# EAGLE design BladeCore-M54 (EAGLE 9.2.1)

## Sheet 1 of 2
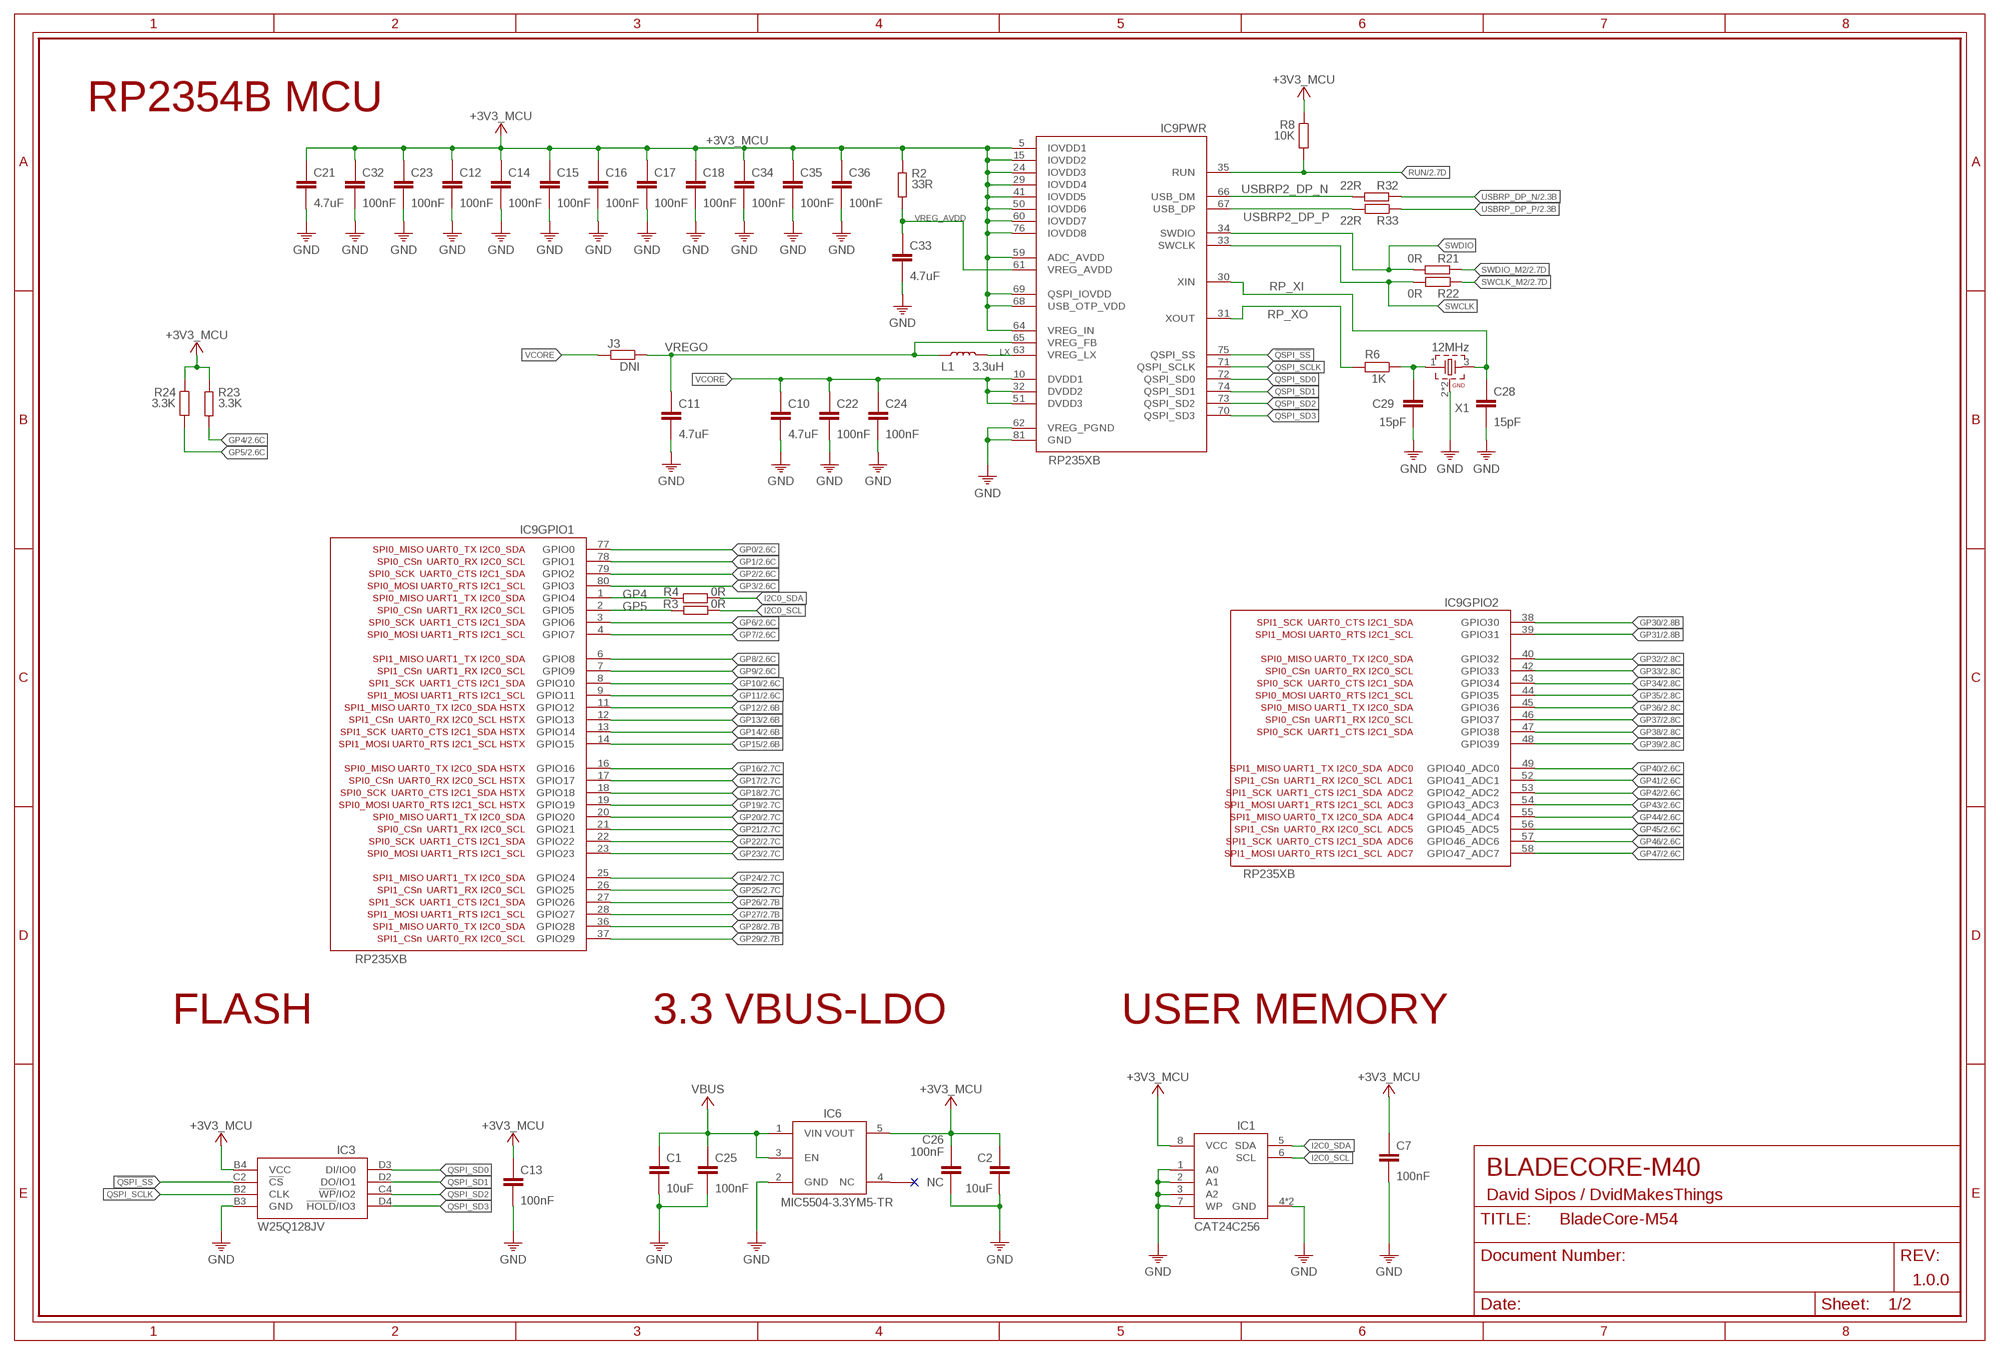
[diagram p0: schematic, sheet 1]

### Parts
C1  10uF  C0805  [0805]
C2  10uF  C0805  [0805]
C7  100nF  C-0201  [0201]
C10  4.7uF  C-0201  [0201]
C11  4.7uF  C-0201  [0201]
C12  100nF  C-0201  [0201]
C13  100nF  C-0201  [0201]
C14  100nF  C-0201  [0201]
C15  100nF  C-0201  [0201]
C16  100nF  C-0201  [0201]
C17  100nF  C-0201  [0201]
C18  100nF  C-0201  [0201]
C21  4.7uF  C-0402  [C0402]
C22  100nF  C-0201  [0201]
C23  100nF  C-0201  [0201]
C24  100nF  C-0201  [0201]
C25  100nF  C-0201  [0201]
C26  100nF  C-0201  [0201]
C28  15pF  C-0201  [0201]
C29  15pF  C-0201  [0201]
C32  100nF  C-0201  [0201]
C33  4.7uF  C-0201  [0201]
C34  100nF  C-0201  [0201]
C35  100nF  C-0201  [0201]
C36  100nF  C-0201  [0201]
IC1  CAT24C512HU5IGT3  CAT24C256-HU4  [SON50P300X200X50-9T130X140N]
IC3  W25Q128JVCIQ TR  W25Q128JVC  [BGA24C100P4X6_800X600X120N]
IC6  MIC5504-3.3YM5-TR  [SOT23-5]
IC9  RP235XB  [QFN80-10X10]
J3  DNI  R0201  [R0201]
L1  3.3uH  L  [SRR5228A]
R2  33R  R0201  [R0201]
R3  0R  R0201  [R0201]
R4  0R  R0201  [R0201]
R6  1K  R0201  [R0201]
R8  10K  R0201  [R0201]
R21  0R  R0201  [R0201]
R22  0R  R0201  [R0201]
R23  3.3K  R0201  [R0201]
R24  3.3K  R0201  [R0201]
R32  22R  R0201  [R0201]
R33  22R  R0201  [R0201]
X1  12MHz  WE-XTAL_CFPX-180_830069944  [WE-XTAL_CFPX-180]

### Nets
!QSPI_SS [50SE]: IC3.C2(!CS) IC9.75(PWR:QSPI_SS)
+3V3_MCU: C2.1 C7.1 C12.1 C13.1 C14.1 C15.1 C16.1 C17.1 C18.1 C21.1 C23.1 C26.1 C32.1 C34.1 C35.1 C36.1 IC1.8(VCC) IC3.B4(VCC) IC6.5(VOUT) IC9.5(PWR:IOVDD1) IC9.15(PWR:IOVDD2) IC9.24(PWR:IOVDD3) IC9.29(PWR:IOVDD4) IC9.41(PWR:IOVDD5) IC9.50(PWR:IOVDD6) IC9.59(PWR:ADC_AVDD) IC9.60(PWR:IOVDD7) IC9.64(PWR:VREG_IN) IC9.68(PWR:USB_OTP_VDD) IC9.69(PWR:QSPI_IOVDD) IC9.76(PWR:IOVDD8) R2.1 R8.1 R23.1 R24.1 ; also sheet 2
GND: C1.2 C2.2 C7.2 C10.2 C11.2 C12.2 C13.2 C14.2 C15.2 C16.2 C17.2 C18.2 C21.2 C22.2 C23.2 C24.2 C25.2 C26.2 C28.2 C29.2 C32.2 C33.2 C34.2 C35.2 C36.2 IC1.1(A0) IC1.2(A1) IC1.3(A2) IC1.4(GND) IC1.7(WP) IC1.9(GND) IC3.B3(GND) IC6.2(GND) IC9.62(PWR:VREG_PGND) IC9.81(PWR:GND) X1.2(GND) X1.4(GND) ; also sheet 2
GP0 [50SE]: IC9.77(GPIO1:GPIO0) ; also sheet 2
GP1 [50SE]: IC9.78(GPIO1:GPIO1) ; also sheet 2
GP2 [50SE]: IC9.79(GPIO1:GPIO2) ; also sheet 2
GP3 [50SE]: IC9.80(GPIO1:GPIO3) ; also sheet 2
GP4 [50SE]: IC9.1(GPIO1:GPIO4) R4.1 R23.2 ; also sheet 2
GP5 [50SE]: IC9.2(GPIO1:GPIO5) R3.1 R24.2 ; also sheet 2
GP6 [50SE]: IC9.3(GPIO1:GPIO6) ; also sheet 2
GP7 [50SE]: IC9.4(GPIO1:GPIO7) ; also sheet 2
GP8 [50SE]: IC9.6(GPIO1:GPIO8) ; also sheet 2
GP9 [50SE]: IC9.7(GPIO1:GPIO9) ; also sheet 2
GP10 [50SE]: IC9.8(GPIO1:GPIO10) ; also sheet 2
GP11 [50SE]: IC9.9(GPIO1:GPIO11) ; also sheet 2
GP12 [50SE]: IC9.11(GPIO1:GPIO12) ; also sheet 2
GP13 [50SE]: IC9.12(GPIO1:GPIO13) ; also sheet 2
GP14 [50SE]: IC9.13(GPIO1:GPIO14) ; also sheet 2
GP15 [50SE]: IC9.14(GPIO1:GPIO15) ; also sheet 2
GP16 [50SE]: IC9.16(GPIO1:GPIO16) ; also sheet 2
GP17 [50SE]: IC9.17(GPIO1:GPIO17) ; also sheet 2
GP18 [50SE]: IC9.18(GPIO1:GPIO18) ; also sheet 2
GP19 [50SE]: IC9.19(GPIO1:GPIO19) ; also sheet 2
GP20 [50SE]: IC9.20(GPIO1:GPIO20) ; also sheet 2
GP21 [50SE]: IC9.21(GPIO1:GPIO21) ; also sheet 2
GP22 [50SE]: IC9.22(GPIO1:GPIO22) ; also sheet 2
GP23 [50SE]: IC9.23(GPIO1:GPIO23) ; also sheet 2
GP24 [50SE]: IC9.25(GPIO1:GPIO24) ; also sheet 2
GP25 [50SE]: IC9.26(GPIO1:GPIO25) ; also sheet 2
GP26 [50SE]: IC9.27(GPIO1:GPIO26) ; also sheet 2
GP27 [50SE]: IC9.28(GPIO1:GPIO27) ; also sheet 2
GP28 [50SE]: IC9.36(GPIO1:GPIO28) ; also sheet 2
GP29 [50SE]: IC9.37(GPIO1:GPIO29) ; also sheet 2
GP30: IC9.38(GPIO2:GPIO30) ; also sheet 2
GP31: IC9.39(GPIO2:GPIO31) ; also sheet 2
GP32: IC9.40(GPIO2:GPIO32) ; also sheet 2
GP33: IC9.42(GPIO2:GPIO33) ; also sheet 2
GP34: IC9.43(GPIO2:GPIO34) ; also sheet 2
GP35: IC9.44(GPIO2:GPIO35) ; also sheet 2
GP36: IC9.45(GPIO2:GPIO36) ; also sheet 2
GP37: IC9.46(GPIO2:GPIO37) ; also sheet 2
GP38: IC9.47(GPIO2:GPIO38) ; also sheet 2
GP39: IC9.48(GPIO2:GPIO39) ; also sheet 2
GP40: IC9.49(GPIO2:GPIO40_ADC0) ; also sheet 2
GP41: IC9.52(GPIO2:GPIO41_ADC1) ; also sheet 2
GP42: IC9.53(GPIO2:GPIO42_ADC2) ; also sheet 2
GP43: IC9.54(GPIO2:GPIO43_ADC3) ; also sheet 2
GP44: IC9.55(GPIO2:GPIO44_ADC4) ; also sheet 2
GP45: IC9.56(GPIO2:GPIO45_ADC5) ; also sheet 2
GP46: IC9.57(GPIO2:GPIO46_ADC6) ; also sheet 2
GP47: IC9.58(GPIO2:GPIO47_ADC7) ; also sheet 2
I2C0_SCL [50SE]: IC1.6(SCL) R3.2
I2C0_SDA [50SE]: IC1.5(SDA) R4.2
LX: IC9.63(PWR:VREG_LX) L1.2
N$53: C29.1 R6.1 X1.1
QSPI_SCLK [50SE]: IC3.B2(CLK) IC9.71(PWR:QSPI_SCLK)
QSPI_SD0 [50SE]: IC3.D3(DI/IO0) IC9.72(PWR:QSPI_SD0)
QSPI_SD1 [50SE]: IC3.D2(DO/IO1) IC9.74(PWR:QSPI_SD1)
QSPI_SD2 [50SE]: IC3.C4(!WP!/IO2) IC9.73(PWR:QSPI_SD2)
QSPI_SD3 [50SE]: IC3.D4(!HOLD!/IO3) IC9.70(PWR:QSPI_SD3)
RP_XI: C28.1 IC9.30(PWR:XIN) X1.3
RP_XO: IC9.31(PWR:XOUT) R6.2
RUN: IC9.35(PWR:RUN) R8.2 ; also sheet 2
SWCLK: IC9.33(PWR:SWCLK) R22.2
SWCLK_M2: R22.1 ; also sheet 2
SWDIO: IC9.34(PWR:SWDIO) R21.2
SWDIO_M2: R21.1 ; also sheet 2
USBRP2_DP_N [90DP]: IC9.66(PWR:USB_DM) R32.2
USBRP2_DP_P [90DP]: IC9.67(PWR:USB_DP) R33.2
USBRP_DP_N [90DP]: R32.1 ; also sheet 2
USBRP_DP_P [90DP]: R33.1 ; also sheet 2
VBUS: C1.1 C25.1 IC6.1(VIN) IC6.3(EN) ; also sheet 2
VCORE: C10.1 C22.1 C24.1 IC9.10(PWR:DVDD1) IC9.32(PWR:DVDD2) IC9.51(PWR:DVDD3) J3.2
VREG_AVDD: C33.1 IC9.61(PWR:VREG_AVDD) R2.2
VREGO: C11.1 IC9.65(PWR:VREG_FB) J3.1 L1.1
Unconnected: IC6.4(NC)

### Notes on the sheet
- RP2354B MCU
- FLASH | 3.3 VBUS-LDO | USER MEMORY
- BLADECORE-M40
- David Sipos / DvidMakesThings
- 1.0.0

## Sheet 2 of 2
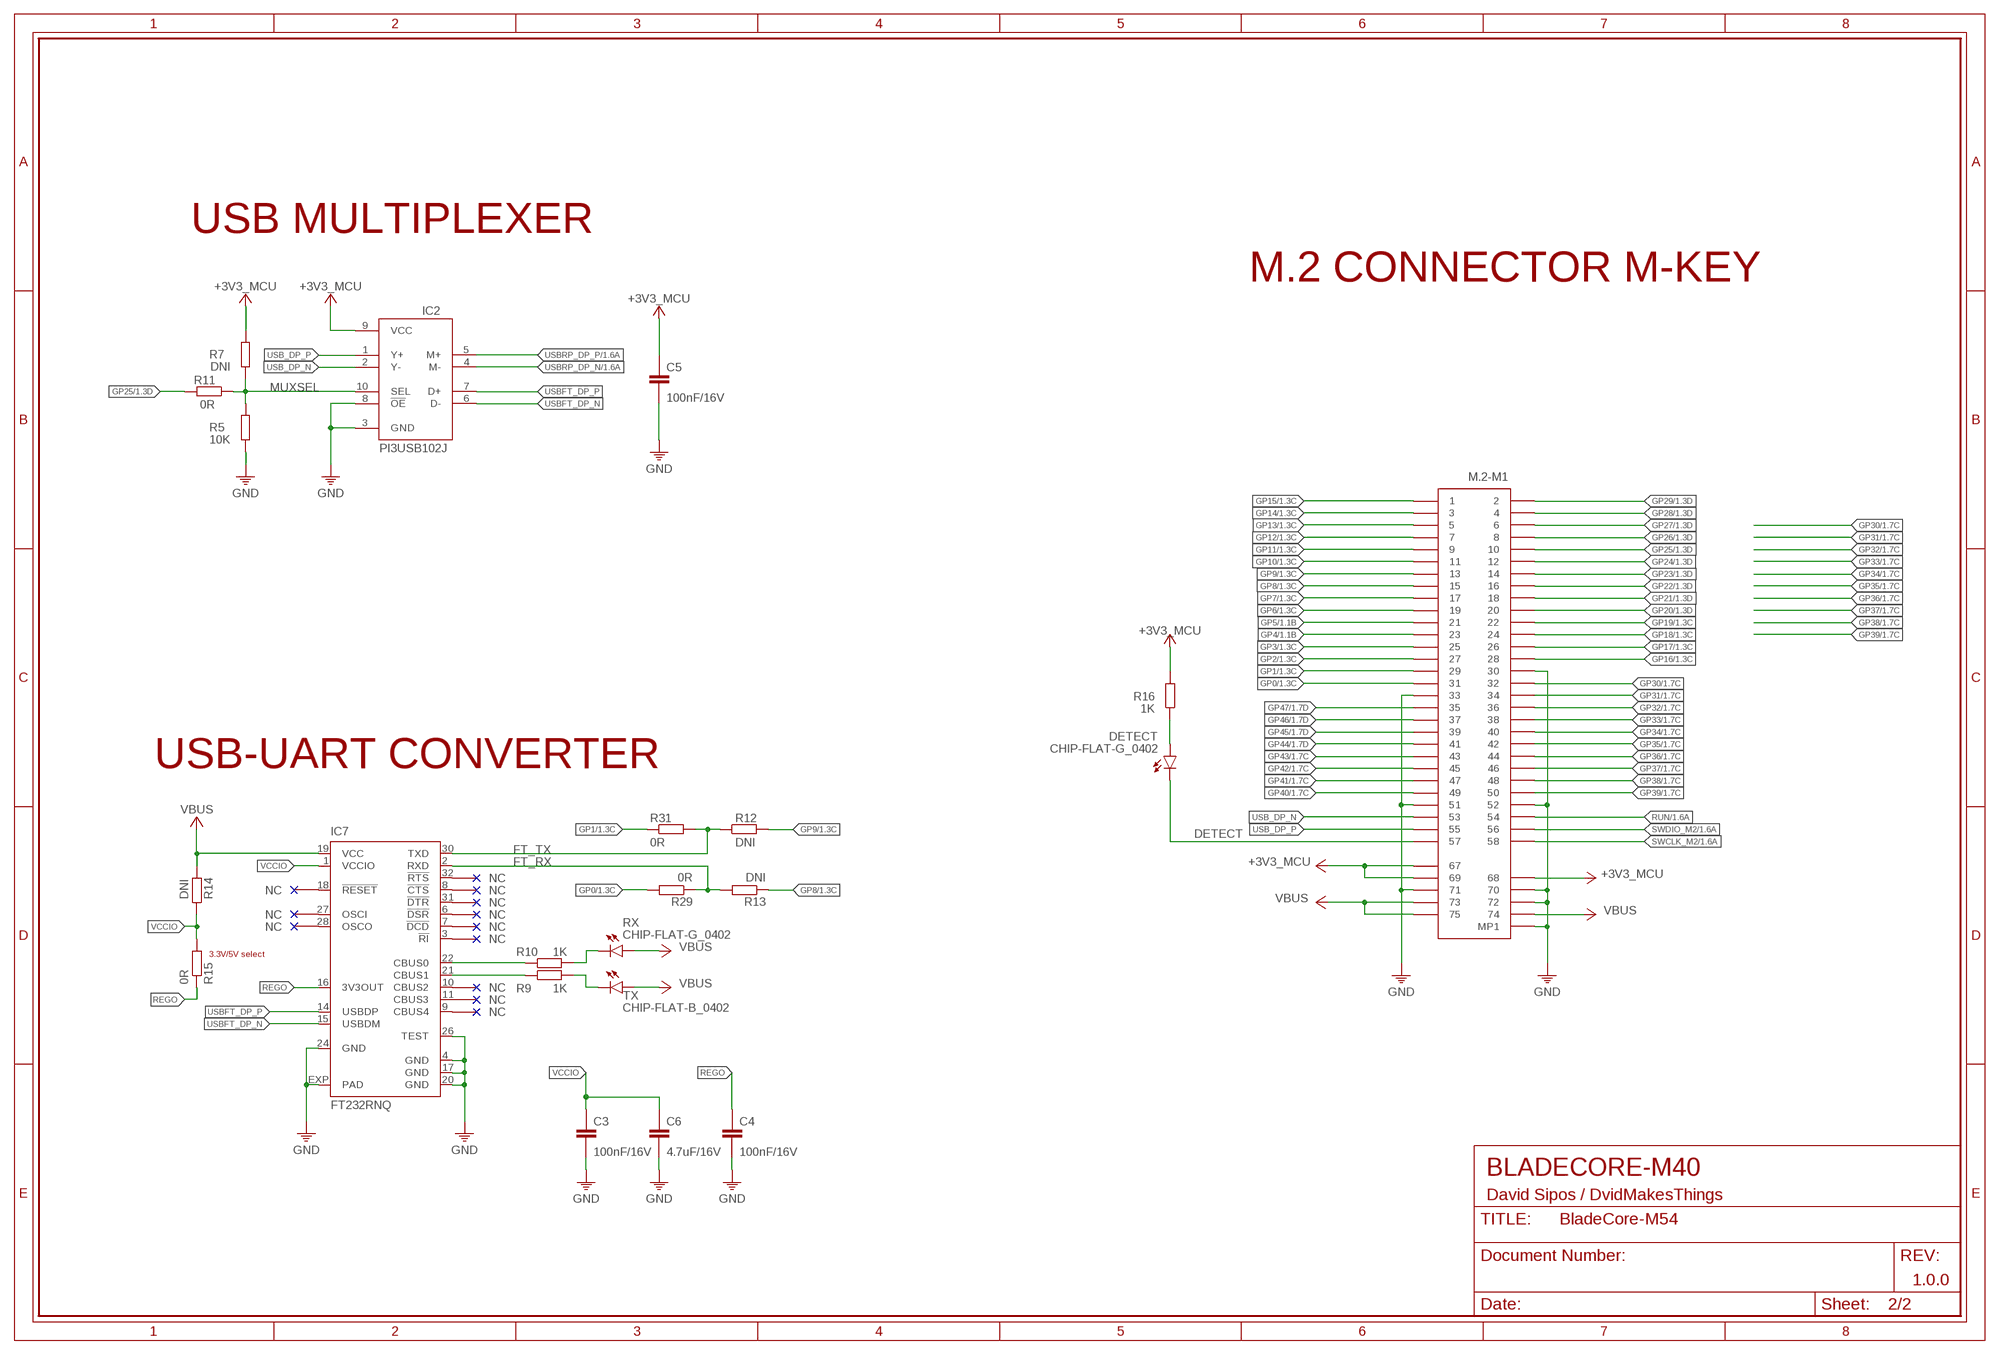
[diagram p1: schematic, sheet 2]

### Parts
C3  100nF/16V  C-0201  [0201]
C4  100nF/16V  C-0201  [0201]
C5  100nF/16V  C-0201  [0201]
C6  4.7uF/16V  C-0201  [0201]
DETECT  CHIP-FLAT-G_0402  [LEDC1005X25N_FLAT-G]
IC2  PI3USB102J  PI3USB102JXUCEX  [QFN40P120X140X35-10N]
IC7  FT232RNQ  FT232RQ  [QFN32]
M.2-M1  M.2-M-KEY  [M.2-M-KEY]
R5  10K  R0201  [R0201]
R7  DNI  R0201  [R0201]
R9  1K  R0201  [R0201]
R10  1K  R0201  [R0201]
R11  0R  R0201  [R0201]
R12  DNI  R0201  [R0201]
R13  DNI  R0201  [R0201]
R14  DNI  R0201  [R0201]
R15  0R  R0201  [R0201]
R16  1K  R0201  [R0201]
R29  0R  R0201  [R0201]
R31  0R  R0201  [R0201]
RX  CHIP-FLAT-G_0402  [LEDC1005X25N_FLAT-G]
TX  CHIP-FLAT-B_0402  [LEDC1005X25N_FLAT-B]

### Nets
+3V3_MCU: C5.1 IC2.9(VCC) M.2-M1.P$67 M.2-M1.P$68 M.2-M1.P$69 R7.2 R16.2 ; also sheet 1
DETECT: DETECT.C M.2-M1.P$57
FT_RX: IC7.2(RXD) R13.2 R29.1
FT_TX: IC7.30(TXD) R12.1 R31.2
GND: C3.2 C4.2 C5.2 C6.2 IC2.3(GND) IC2.8(!OE) IC7.4(GND) IC7.17(GND) IC7.20(GND) IC7.24(GND) IC7.26(TEST) IC7.EXP(PAD) M.2-M1.MT1(MP1) M.2-M1.P$30 M.2-M1.P$33 M.2-M1.P$51 M.2-M1.P$52 M.2-M1.P$70 M.2-M1.P$71 M.2-M1.P$72 R5.1 ; also sheet 1
GP0 [50SE]: M.2-M1.P$31 R29.2 ; also sheet 1
GP1 [50SE]: M.2-M1.P$29 R31.1 ; also sheet 1
GP2 [50SE]: M.2-M1.P$27 ; also sheet 1
GP3 [50SE]: M.2-M1.P$25 ; also sheet 1
GP4 [50SE]: M.2-M1.P$23 ; also sheet 1
GP5 [50SE]: M.2-M1.P$21 ; also sheet 1
GP6 [50SE]: M.2-M1.P$19 ; also sheet 1
GP7 [50SE]: M.2-M1.P$17 ; also sheet 1
GP8 [50SE]: M.2-M1.P$15 R13.1 ; also sheet 1
GP9 [50SE]: M.2-M1.P$13 R12.2 ; also sheet 1
GP10 [50SE]: M.2-M1.P$11 ; also sheet 1
GP11 [50SE]: M.2-M1.P$9 ; also sheet 1
GP12 [50SE]: M.2-M1.P$7 ; also sheet 1
GP13 [50SE]: M.2-M1.P$5 ; also sheet 1
GP14 [50SE]: M.2-M1.P$3 ; also sheet 1
GP15 [50SE]: M.2-M1.P$1 ; also sheet 1
GP16 [50SE]: M.2-M1.P$28 ; also sheet 1
GP17 [50SE]: M.2-M1.P$26 ; also sheet 1
GP18 [50SE]: M.2-M1.P$24 ; also sheet 1
GP19 [50SE]: M.2-M1.P$22 ; also sheet 1
GP20 [50SE]: M.2-M1.P$20 ; also sheet 1
GP21 [50SE]: M.2-M1.P$18 ; also sheet 1
GP22 [50SE]: M.2-M1.P$16 ; also sheet 1
GP23 [50SE]: M.2-M1.P$14 ; also sheet 1
GP24 [50SE]: M.2-M1.P$12 ; also sheet 1
GP25 [50SE]: M.2-M1.P$10 R11.2 ; also sheet 1
GP26 [50SE]: M.2-M1.P$8 ; also sheet 1
GP27 [50SE]: M.2-M1.P$6 ; also sheet 1
GP28 [50SE]: M.2-M1.P$4 ; also sheet 1
GP29 [50SE]: M.2-M1.P$2 ; also sheet 1
GP30: M.2-M1.P$32 ; also sheet 1
GP31: M.2-M1.P$34 ; also sheet 1
GP32: M.2-M1.P$36 ; also sheet 1
GP33: M.2-M1.P$38 ; also sheet 1
GP34: M.2-M1.P$40 ; also sheet 1
GP35: M.2-M1.P$42 ; also sheet 1
GP36: M.2-M1.P$44 ; also sheet 1
GP37: M.2-M1.P$46 ; also sheet 1
GP38: M.2-M1.P$48 ; also sheet 1
GP39: M.2-M1.P$50 ; also sheet 1
GP40: M.2-M1.P$49 ; also sheet 1
GP41: M.2-M1.P$47 ; also sheet 1
GP42: M.2-M1.P$45 ; also sheet 1
GP43: M.2-M1.P$43 ; also sheet 1
GP44: M.2-M1.P$41 ; also sheet 1
GP45: M.2-M1.P$39 ; also sheet 1
GP46: M.2-M1.P$37 ; also sheet 1
GP47: M.2-M1.P$35 ; also sheet 1
MUXSEL [50SE]: IC2.10(SEL) R5.2 R7.1 R11.1
N$6: DETECT.A R16.1
N$43: IC7.22(CBUS0) R10.1
N$109: IC7.21(CBUS1) R9.1
N$110: R9.2 TX.C
N$111: R10.2 RX.C
REGO: C4.1 IC7.16(3V3OUT) R15.1
RUN: M.2-M1.P$54 ; also sheet 1
SWCLK_M2: M.2-M1.P$58 ; also sheet 1
SWDIO_M2: M.2-M1.P$56 ; also sheet 1
USB_DP_N [90DP]: IC2.2(Y-) M.2-M1.P$53
USB_DP_P [90DP]: IC2.1(Y+) M.2-M1.P$55
USBFT_DP_N [90DP]: IC2.6(D-) IC7.15(USBDM)
USBFT_DP_P [90DP]: IC2.7(D+) IC7.14(USBDP)
USBRP_DP_N [90DP]: IC2.4(M-) ; also sheet 1
USBRP_DP_P [90DP]: IC2.5(M+) ; also sheet 1
VBUS: IC7.19(VCC) M.2-M1.P$73 M.2-M1.P$74 M.2-M1.P$75 R14.2 RX.A TX.A ; also sheet 1
VCCIO: C3.1 C6.1 IC7.1(VCCIO) R14.1 R15.2
Unconnected: IC7.3(!RI) IC7.6(!DSR) IC7.7(!DCD) IC7.8(!CTS) IC7.9(CBUS4) IC7.10(CBUS2) IC7.11(CBUS3) IC7.18(!RESET) IC7.27(OSCI) IC7.28(OSCO) IC7.31(!DTR) IC7.32(!RTS)

### Notes on the sheet
- USB MULTIPLEXER
- M.2 CONNECTOR M-KEY
- USB-UART CONVERTER
- 3.3V/5V select
- BLADECORE-M40
- David Sipos / DvidMakesThings
- 1.0.0

## Library data of the parts
C1-C7 C10-C18 C21-C26 C28 C29 C32-C36 = ds_passive:C
DETECT RX = LED:CHIP-FLAT-G: Green LED - Generic; CATEGORY: LED; COLOR: Green; DESCRIPTION: Green LED Indication 0402 (1005 Metric); PACKAGE_SIZE: 0402; PACKAGE_TYPE: SMD; SUBCATEGORY: Chip LED; TYPE: Square with Flat Top
IC1 = ds_ic_memory:CAT24C256: The CAT24C256 is a EEPROM Serial 256−Kb I2C, internally organized as 32,768 words of 8 bits each. It features a 64−byte page write buffer and supports the Standard (100 kHz), Fast (400 kHz) and Fast−Plus (1 MHz) I2C protocol. Write operations can be inhibited by taking the WP pin High (this protects the entire memory). External address pins make it possible to address up to eight CAT24C256 devices on the same bus. On−Chip ECC (Error Correction Code) makes the device suitable for high reliability applications.
IC2 = ds_ic_peripherals:PI3USB102J: USB 2.0 High-Speed (480Mbps) Switch with 5V Protection
IC3 = ds_ic_memory:W25Q128JV: 3V 128M-BIT SERIAL FLASH MEMORY WITH DUAL/QUAD SPI & QPI & DTR
IC6 = ds_ic_vreg:MIC5504-3.3YM5-TR: The MIC5501/2/3/4 is an advanced general-purpose LDO ideal for powering general-purpose portable devices. The MIC5501/2/3/4 family of products provides a high-performance 300mA LDO
IC7 = ds_ic_peripherals:FT232RQ: FT232R USB UART IC; DATASHEET: https://ftdichip.com/wp-content/uploads/2020/08/DS_FT232R.pdf
IC9 = ds_ic_mcu:RP235XB: RP2350 is a new family of microcontrollers from Raspberry Pi that offers significant enhancements over RP2040. Key features include: • Dual Cortex-M33 or Hazard3 processors at 150 MHz • 520 kB on-chip SRAM, in 10 independent banks • 8 kB of one-time-programmable storage (OTP) • Up to 16 MB of external QSPI flash/PSRAM via dedicated QSPI bus ◦Additional 16 MB flash/PSRAM accessible via optional second chip-select • On-chip switched-mode power supply to generate core voltage ◦Low-quiescent-current LDO mode can be enabled for sleep states • 2× on-chip PLLs for internal or external clock generation • Security features: ◦Optional boot signing, enforced by on-chip mask ROM, with key fingerprint in OTP ◦Protected OTP storage for optional boot decryption key ◦Global bus filtering based on Arm or RISC-V security/privilege levels ◦Peripherals, GPIOs and DMA channels individually assignable to security domains ◦Hardware mitigations for fault injection attacks ◦Hardware SHA-256 accelerator • Peripherals: ◦2× UARTs ◦2× SPI controllers ◦2× I2C controllers ◦24× PWM channels ◦USB 1.1 controller and PHY, with host and device support ◦12× PIO state machines ◦1× HSTX peripheral
J3 R2-R16 R21-R24 R29 R31-R33 = ds_passive:R
L1 = ds_passive:L
M.2-M1 = ds_con:M.2-M-KEY
TX = LED:CHIP-FLAT-B: Blue LED - Generic; CATEGORY: LED; COLOR: Blue; DESCRIPTION: Blue LED Indication 0402 (1005 Metric); PACKAGE_SIZE: 0402; PACKAGE_TYPE: SMD; SUBCATEGORY: Chip LED; TYPE: Square with Flat Top
X1 = Wurth_Quartz Crystals & Oscillators_WE-XTAL:WE-XTAL_CFPX-180: WE-XTAL Quartz Crystal Characteristics SMT and THT models Hermetically sealed Frequencies between 1.8432 MHz and 50 MHz Tolerances down to ±10 ppm available Maximum operating temperatures range: -40 °C to 85 °C Stabilities down to ±10 ppm available Applications Microprocessor Wireless Communication Devices Industrial Devices Wired Communication (e.g. Ethernet and USB) IoT Optical Network Audio and Multimedia Devices Test and Measurement Equipment Navigation and Locators Wearables <https://www.we-online.com/catalog/media/o135919v209%20Family_WE-XTAL_IQXC-42.jpg> Details see: https://www.we-online.com/catalog/en/WE-XTAL Updated by Ella Wu , 2020-11-23 2020 (C) Wurth Elektronik; C-LOAD: 15pF; DATASHEET-URL: https://www.we-online.com/catalog/datasheet/830069944.pdf; MOUNT: SMT; PART-NUMBER: 830069944; STABILITY: 30ppm; TOLERANCE: ±20ppm

## Net classes
0 default: width 0.17 mm, drill 0.15 mm, clearance 0.178 mm
1 50SE: width 0.17 mm, drill 0.15 mm, clearance 0.178 mm
2 90DP: width 0.167 mm, drill 0.15 mm, clearance 0.178 mm
3 50SE_INNER: width 0.147 mm, drill 0.15 mm, clearance 0.178 mm

## Board
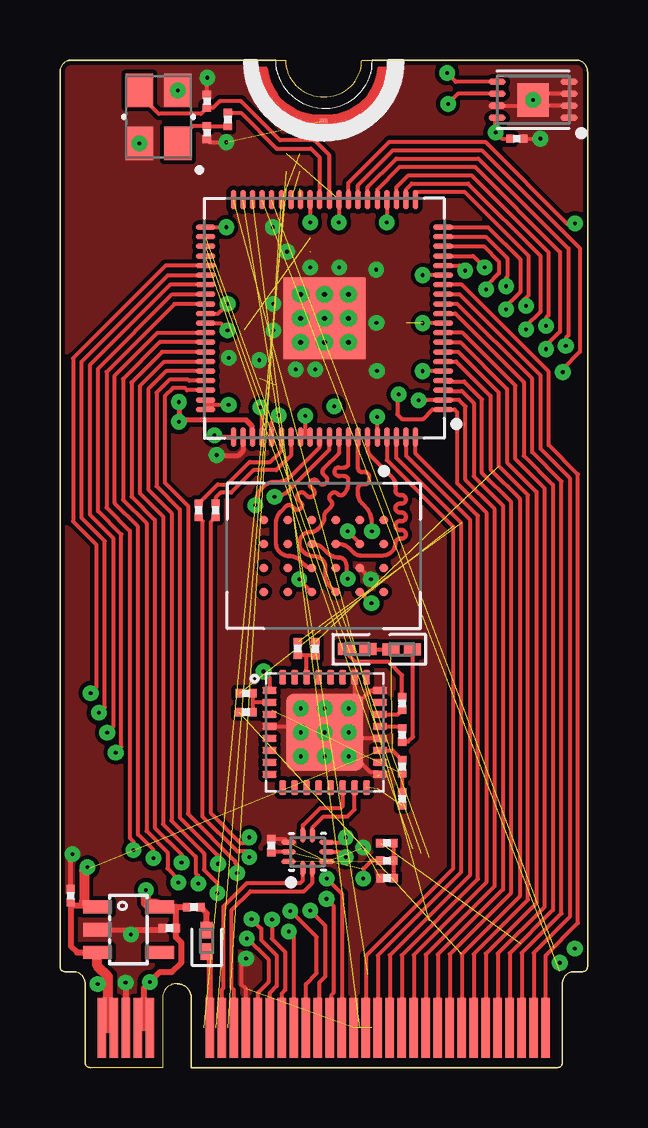
[diagram p2: board, top side]
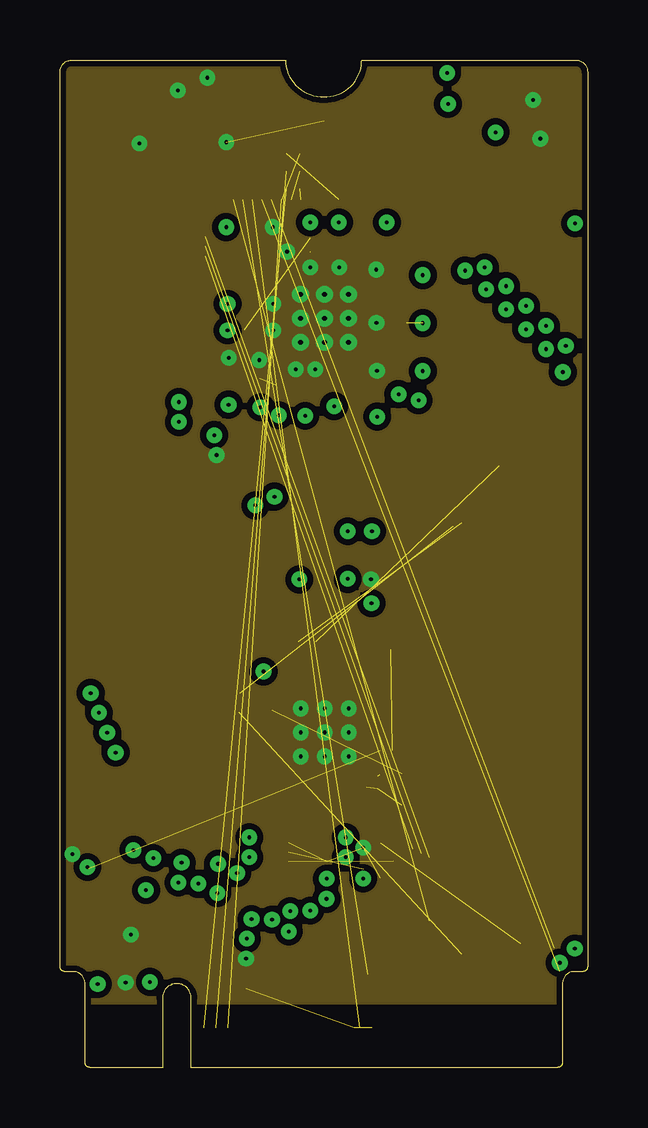
[diagram p3: board, inner layer L2-GND]
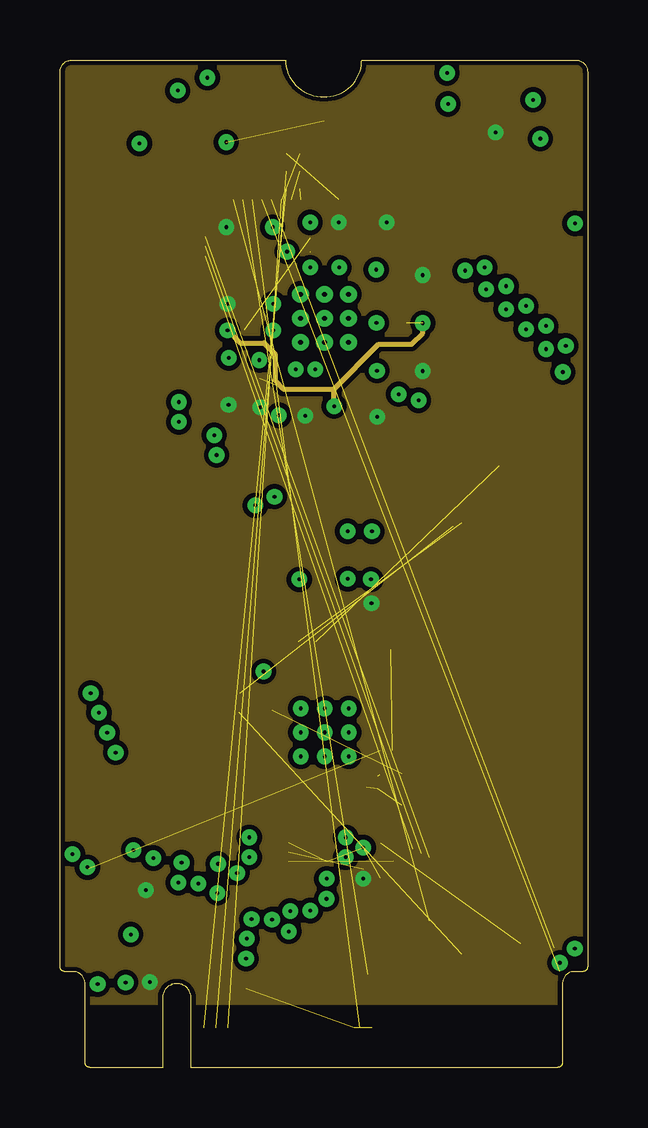
[diagram p4: board, inner layer L3-PWR]
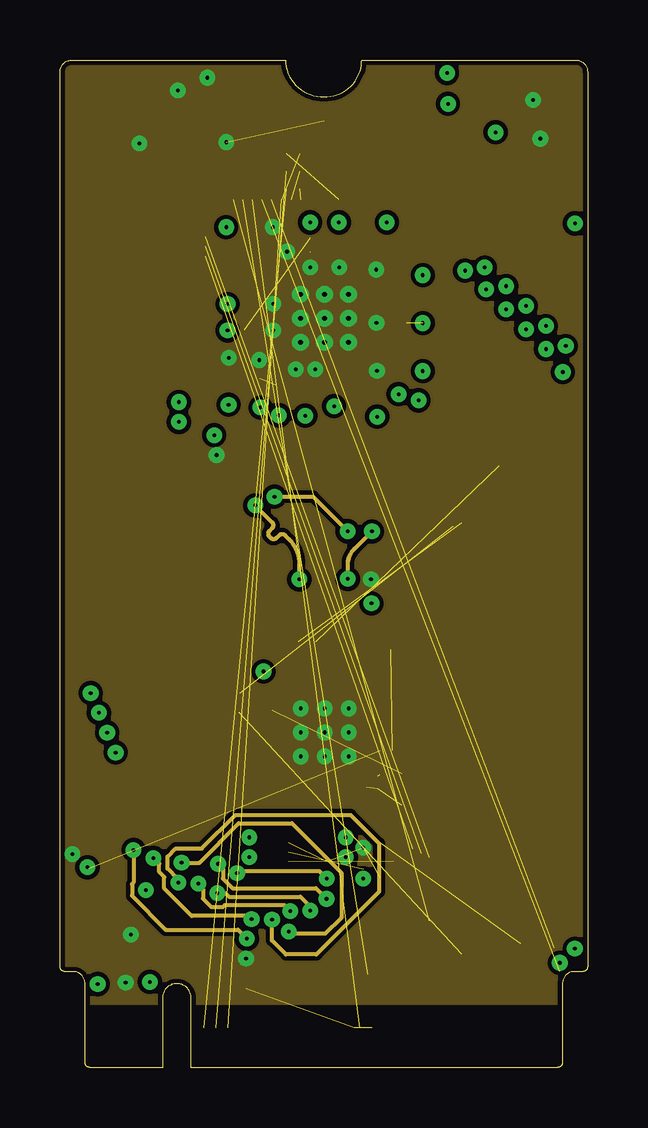
[diagram p5: board, inner layer L4-SIG]
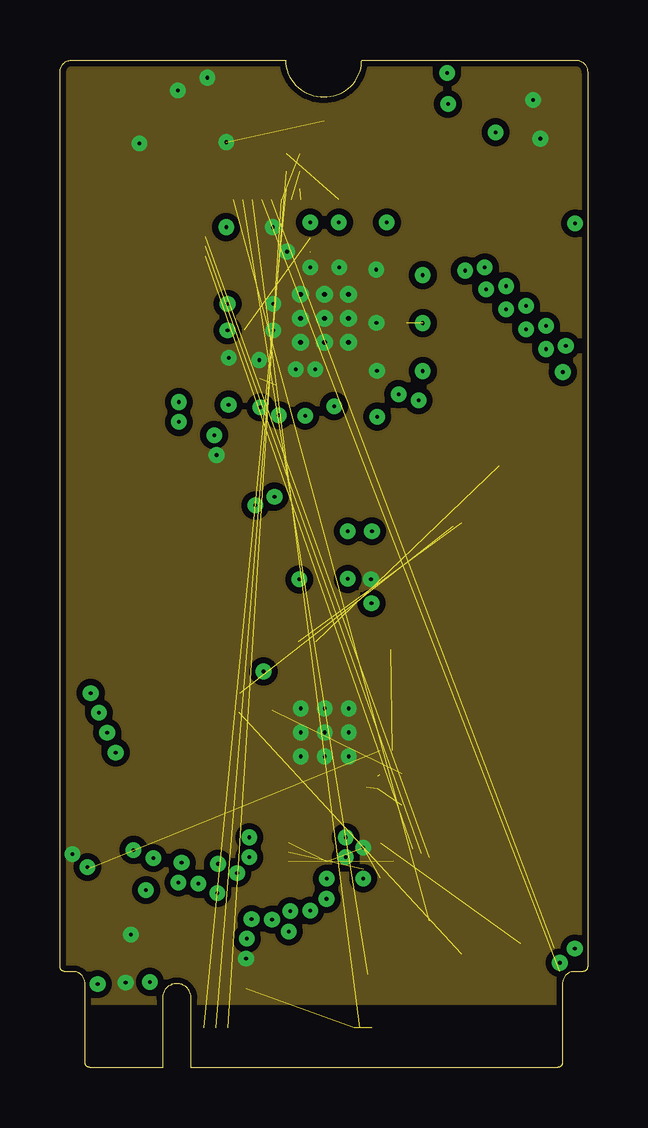
[diagram p6: board, inner layer L5-GND]
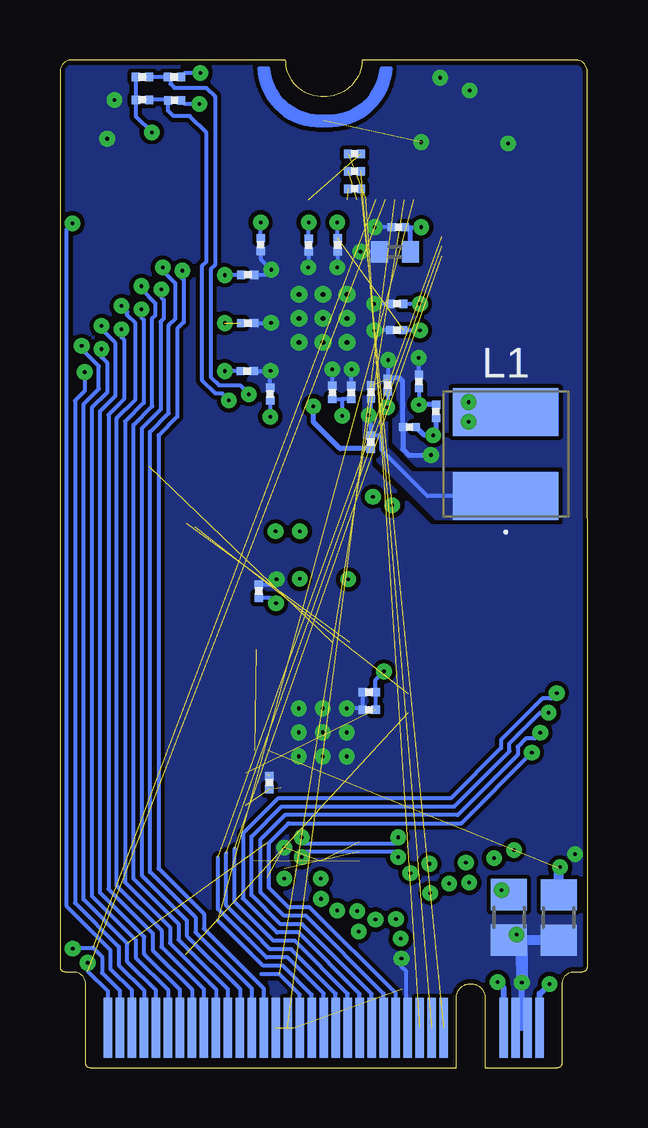
[diagram p7: board, bottom side, seen from below]

Size 22 x 42 mm. Coordinates in mm from the lower left corner, seen from the top.
Outline: 0,4.24 0,41.5 arc-90 0.5,42 9.4,42 arc90 11,40.47 arc90 12.58,41.92 12.6,42 21.5,42 arc-90 22,41.5 22,4.2 arc-90 21.8,4 21.45,4 arc90 20.95,3.5 20.95,0.2 arc-90 20.75,0 5.47,0 5.47,2.9 arc90 4.87,3.5 arc90 4.28,2.9 4.28,0 1.25,0 arc-90 1.05,0.2 1.05,3.5 arc90 0.55,4 0.2,4 arc-90 0,4.2 0,4.24
Copper layers (1+2*3+14*15+16): L1-HS 0.035mm / dielectric 0.2104mm / L2-GND 0.0152mm / dielectric 0.075mm / L3-PWR 0.0152mm / dielectric 0.1088mm / L4-SIG 0.0152mm / dielectric 0.075mm / L5-GND 0.0152mm / dielectric 0.2104mm / L6-SIG 0.035mm
Design rules "JLC06161H-3313_6-layer *": minimum track width 0.1mm, minimum drill 0.15mm, track to track 3.5mil, track to pad 3.5mil, pad to pad 3.5mil, via to via 3.5mil, smd to smd 3.5mil, copper to edge 0.2mm, drill to drill 6mil, minimum pad ring 8mil, minimum via ring 0.25mm, stop-mask expansion 0.05mm, vias tented up to drill 16mil, thermal gap 10mil

### Footprints (pad centres in the part's own frame; a part is rotated, then mirrored left to right if it is on the bottom)
0805 = smd 1.3 x 1.5: 1 -0.95,0; 2 0.95,0
0201 = smd 0.34 x 0.35: 1 -0.275,0; 2 0.275,0
C0402 = smd 0.7 x 0.9: 1 -0.65,0; 2 0.65,0
LEDC1005X25N_FLAT-G = smd 0.7 x 0.5: A 0.45,0; C -0.45,0
SON50P300X200X50-9T130X140N = smd 0.711 x 0.27: 1 -1.501,0.75; 2 -1.501,0.25; 3 -1.501,-0.25; 4 -1.501,-0.75; 5 1.501,-0.75; 6 1.501,-0.25; 7 1.501,0.25; 8 1.501,0.75 | smd 1.3 x 1.4: 9 0,0
QFN40P120X140X35-10N = smd 0.612 x 0.203: 1 -0.7,0.2; 2 -0.7,-0.2; 6 0.7,-0.2; 7 0.7,0.2 | smd 0.203 x 0.612: 3 -0.4,-0.8; 4 0,-0.8; 5 0.4,-0.8; 8 0.4,0.8; 9 0,0.8; 10 -0.4,0.8
BGA24C100P4X6_800X600X120N = smd 0.35 x 0.35: A1 -1.5,2.5; A2 -0.5,2.5; A3 0.5,2.5; A4 1.5,2.5; B1 -1.5,1.5; B2 -0.5,1.5; B3 0.5,1.5; B4 1.5,1.5; C1 -1.5,0.5; C2 -0.5,0.5; C3 0.5,0.5; C4 1.5,0.5; D1 -1.5,-0.5; D2 -0.5,-0.5; D3 0.5,-0.5; D4 1.5,-0.5; E1 -1.5,-1.5; E2 -0.5,-1.5; E3 0.5,-1.5; E4 1.5,-1.5; F1 -1.5,-2.5; F2 -0.5,-2.5; F3 0.5,-2.5; F4 1.5,-2.5
SOT23-5 = smd 0.55 x 1.2: 1 -0.95,-1.3; 2 0,-1.3; 3 0.95,-1.3; 4 0.95,1.3; 5 -0.95,1.3
QFN32 = smd 0.6 x 0.3: 1 -2.3,1.75; 2 -2.3,1.25; 3 -2.3,0.75; 4 -2.3,0.25; 5 -2.3,-0.25; 6 -2.3,-0.75; 7 -2.3,-1.25; 8 -2.3,-1.75; 17 2.3,-1.75; 18 2.3,-1.25; 19 2.3,-0.75; 20 2.3,-0.25; 21 2.3,0.25; 22 2.3,0.75; 23 2.3,1.25; 24 2.3,1.75 | smd 0.3 x 0.6: 9 -1.75,-2.3; 10 -1.25,-2.3; 11 -0.75,-2.3; 12 -0.25,-2.3; 13 0.25,-2.3; 14 0.75,-2.3; 15 1.25,-2.3; 16 1.75,-2.3; 25 1.75,2.3; 26 1.25,2.3; 27 0.75,2.3; 28 0.25,2.3; 29 -0.25,2.3; 30 -0.75,2.3; 31 -1.25,2.3; 32 -1.75,2.3 | smd 3.2 x 3.2: EXP 0,0
QFN80-10X10 = smd 0.811 x 0.22: 1 -4.951,3.8; 2 -4.951,3.4; 3 -4.951,3; 4 -4.951,2.6; 5 -4.951,2.2; 6 -4.951,1.8; 7 -4.951,1.4; 8 -4.951,1; 9 -4.951,0.6; 10 -4.951,0.2; 11 -4.951,-0.2; 12 -4.951,-0.6; 13 -4.951,-1; 14 -4.951,-1.4; 15 -4.951,-1.8; 16 -4.951,-2.2; 17 -4.951,-2.6; 18 -4.951,-3; 19 -4.951,-3.4; 20 -4.951,-3.8; 41 4.951,-3.8; 42 4.951,-3.4; 43 4.951,-3; 44 4.951,-2.6; 45 4.951,-2.2; 46 4.951,-1.8; 47 4.951,-1.4; 48 4.951,-1; 49 4.951,-0.6; 50 4.951,-0.2; 51 4.951,0.2; 52 4.951,0.6; 53 4.951,1; 54 4.951,1.4; 55 4.951,1.8; 56 4.951,2.2; 57 4.951,2.6; 58 4.951,3; 59 4.951,3.4; 60 4.951,3.8 | smd 0.22 x 0.811: 21 -3.8,-4.951; 22 -3.4,-4.951; 23 -3,-4.951; 24 -2.6,-4.951; 25 -2.2,-4.951; 26 -1.8,-4.951; 27 -1.4,-4.951; 28 -1,-4.951; 29 -0.6,-4.951; 30 -0.2,-4.951; 31 0.2,-4.951; 32 0.6,-4.951; 33 1,-4.951; 34 1.4,-4.951; 35 1.8,-4.951; 36 2.2,-4.951; 37 2.6,-4.951; 38 3,-4.951; 39 3.4,-4.951; 40 3.8,-4.951; 61 3.8,4.951; 62 3.4,4.951; 63 3,4.951; 64 2.6,4.951; 65 2.2,4.951; 66 1.8,4.951; 67 1.4,4.951; 68 1,4.951; 69 0.6,4.951; 70 0.2,4.951; 71 -0.2,4.951; 72 -0.6,4.951; 73 -1,4.951; 74 -1.4,4.951; 75 -1.8,4.951; 76 -2.2,4.951; 77 -2.6,4.951; 78 -3,4.951; 79 -3.4,4.951; 80 -3.8,4.951 | smd 3.4 x 3.4: 81 0,0
R0201 = smd 0.34 x 0.35: 1 -0.275,0; 2 0.275,0
SRR5228A = smd 4.4 x 2: 1 0,1.75; 2 0,-1.75
M.2-M-KEY = smd 0.305 x 0.152: MT1 -0.5,17.6 | smd 0.35 x 2.5: P$1 8.75,-20.21; P$3 8.25,-20.21; P$5 7.75,-20.21; P$7 7.25,-20.21; P$9 6.75,-20.21; P$11 6.25,-20.21; P$13 5.75,-20.21; P$15 5.25,-20.21; P$17 4.75,-20.21; P$19 4.25,-20.21; P$21 3.75,-20.21; P$23 3.25,-20.21; P$25 2.75,-20.21; P$27 2.25,-20.21; P$29 1.75,-20.21; P$31 1.25,-20.21; P$33 0.75,-20.21; P$35 0.25,-20.21; P$37 -0.25,-20.21; P$39 -0.75,-20.21; P$41 -1.25,-20.21; P$43 -1.75,-20.21; P$45 -2.25,-20.21; P$47 -2.75,-20.21; P$49 -3.25,-20.21; P$51 -3.75,-20.21; P$53 -4.25,-20.21; P$55 -4.75,-20.21; P$57 -5.25,-20.21; P$67 -7.75,-20.21; P$69 -8.25,-20.21; P$71 -8.75,-20.21; P$73 -9.25,-20.21; P$75 -9.75,-20.21 | smd 0.35 x 2.5 bottom: P$2 8.5,-20.21; P$4 8,-20.21; P$6 7.5,-20.21; P$8 7,-20.21; P$10 6.5,-20.21; P$12 6,-20.21; P$14 5.5,-20.21; P$16 5,-20.21; P$18 4.5,-20.21; P$20 4,-20.21; P$22 3.5,-20.21; P$24 3,-20.21; P$26 2.5,-20.21; P$28 2,-20.21; P$30 1.5,-20.21; P$32 1,-20.21; P$34 0.5,-20.21; P$36 0,-20.21; P$38 -0.5,-20.21; P$40 -1,-20.21; P$42 -1.5,-20.21; P$44 -2,-20.21; P$46 -2.5,-20.21; P$48 -3,-20.21; P$50 -3.5,-20.21; P$52 -4,-20.21; P$54 -4.5,-20.21; P$56 -5,-20.21; P$58 -5.5,-20.21; P$68 -8,-20.21; P$70 -8.5,-20.21; P$72 -9,-20.21; P$74 -9.5,-20.21
LEDC1005X25N_FLAT-B = smd 0.7 x 0.5: A 0.45,0; C -0.45,0
WE-XTAL_CFPX-180 = smd 1.4 x 1.15: 1 -1.1,-0.8; 2 1.1,-0.8; 3 1.1,0.8; 4 -1.1,0.8

### Placement (x,y rotation side)
C1  1.2,6.25 270 bottom
C2  3.28,6.26 270 bottom
C3  9.11,15.65 180 bottom
C4  13.27,11.88 90 bottom
C5  8.81,9.25 90 top
C6  9.11,14.91 180 bottom
C7  19.05,38.72 0 top
C10  10.42,34.29 270 bottom
C11  9.03,28.16 90 bottom
C12  10.64,28.14 90 bottom
C13  13.71,19.86 90 bottom
C14  13.24,28.07 90 bottom
C15  14.19,29.03 0 bottom
C16  14.17,33.05 0 bottom
C17  13.63,34.3 270 bottom
C18  11.63,34.28 270 bottom
C21  8.03,34 180 bottom
C22  7.96,30.74 180 bottom
C23  9.85,28.14 90 bottom
C24  14.17,31.03 0 bottom
C25  0.45,7.16 90 top
C26  4.56,5.81 180 top
C28  6.13,40.28 90 top
C29  6.13,38.97 270 top
C32  8.33,28.45 90 bottom
C33  7.43,26.7 180 bottom
C34  7.89,35.03 180 bottom
C35  7.95,31.84 180 bottom
C36  7.03,28.6 90 bottom
DETECT  6.12,5.28 90 top
IC1  19.73,40.34 180 top
IC2  10.33,8.99 90 top
IC3  11,21.33 270 top
IC6  2.86,5.75 270 top
IC7  11.04,13.97 0 top
IC9  11.03,31.23 180 top
J3  9.04,26.07 270 bottom
L1  3.41,25.57 180 bottom
M.2-M1  11.5,21.86 0 top
R2  6.32,27.35 270 bottom
R3  17.22,40.32 0 bottom
R4  17.23,41.29 0 bottom
R5  13.64,7.9 0 top
R6  7,39.52 90 top
R7  13.63,8.62 180 top
R8  9.72,38.09 180 bottom
R9  14.27,13.86 270 top
R10  14.27,15.18 90 top
R11  13.63,9.36 180 top
R12  10.65,17.46 90 top
R13  7.75,14.81 0 top
R14  14.27,12.54 90 top
R15  14.27,11.2 90 top
R16  5.58,6.69 180 top
R21  9.72,37.36 180 bottom
R22  9.72,36.63 180 bottom
R23  18.56,41.29 0 bottom
R24  18.56,40.34 0 bottom
R29  7.76,15.6 180 top
R31  9.92,17.47 270 top
R32  5.78,23.23 90 top
R33  6.49,23.23 90 top
RX  12.39,17.44 0 top
TX  14.25,17.43 180 top
U$1  [DMT]  60.44,-7 315 bottom  (outside the outline)
X1  4.11,39.62 90 top

### Tracks (layer width: path | path; a pad name or v marks a point on that pad's centre or on a via)
!QSPI_SS
  L1-HS 0.17: IC3.C2 11.6,21.83 arc-45 12.08,21.63 12.24,21.48 arc45 12.56,21.34 13.46,21.34 arc90 13.99,21.87 arc-90 14.16,22.04 14.25,22.04 arc90 14.42,22.22 14.42,22.23 arc90 14.25,22.41 14.16,22.41 arc-90 13.99,22.58 13.99,22.6 arc-90 14.16,22.77 14.25,22.77 arc90 14.42,22.95 14.42,22.96 arc90 14.25,23.14 14.16,23.14 arc-90 13.99,23.31 13.99,23.33 arc-90 14.16,23.5 14.25,23.5 arc90 14.42,23.68 14.42,23.7 arc90 14.25,23.87 14.16,23.87 arc-90 13.99,24.04 13.99,24.26 arc45 13.84,24.62 12.92,25.54 arc-45 12.83,25.76 IC9.75
+3V3_MCU  (via drill 0.15)  (2 unrouted)
  L1-HS 0.17: IC9.64 8.43,27.45 v8.36,27.52 | IC9.68 10.23,26.28 | 10.23,26.28 IC9.69 | 10.23,26.28 v10.23,27.17 | IC9.76 v13.23,27.13 | IC9.5 v15.13,29.03 | IC9.15 v15.13,33.03 | IC9.24 v13.63,35.23 | IC9.29 v11.63,35.23 | IC9.41 v6.93,35.03 | IC9.50 6.59,31.43 v6.99,31.83 | IC9.59 6.08,27.64 | 6.08,27.64 6.08,27.63 | 6.08,27.63 IC9.60 | 6.08,27.63 v7.03,27.63 | 6.08,27.64 | IC3.B4 v12.98,19.35 v12.99,19.35 | IC1.8 18.17,39.53 v18.17,38.99 18.43,38.72 C7.1 | IC2.9 8.82,8.99 C5.1 | R7.2 12.98,8.62 12.65,8.29 v12.65,7.88
  L1-HS 0.254: M.2-M1.P$69 M.2-M1.P$68 | M.2-M1.P$68 M.2-M1.P$67 | M.2-M1.P$68 3.5,3.32 v3.75,3.57 4.16,3.98 4.67,3.98 5.06,4.38 5.06,5.2 4.83,5.43 C26.1 4.83,6.7 | IC6.5 4.83,6.7 | 4.83,6.7 5.29,6.7 R16.2 | 3.63,6.82 3.59,6.86
  L1-HS 0.406: IC6.5 4.04,6.82 3.63,6.82 | 3.59,6.86 v3.59,7.4
  L6-SIG 0.17: C36.1 v7.03,27.63 | C32.1 8.33,27.55 v8.36,27.52 | C23.1 10.23,27.87 | C12.1 10.23,27.87 | 10.23,27.87 v10.23,27.17 | C14.1 v13.23,27.13 | C15.1 v15.13,29.03 | C16.1 14.46,33.03 v15.13,33.03 | C17.1 v13.63,35.23 | C18.1 v11.63,35.23 | C34.1 7.45,35.03 v6.93,35.03 | C35.1 v7,31.84 v6.99,31.83 | C13.1 13.22,19.59 v12.99,19.35 | R23.1 R24.1 18.84,39.65 v18.17,38.99
  L6-SIG 0.2: C21.1 7.38,34.96 7.45,35.03 | R2.1 v7.03,27.63
  L6-SIG 0.254: M.2-M1.P$68 3.5,3.32 v3.75,3.57
  L6-SIG 0.406: C2.1 3.4,7.21 v3.59,7.4
  pour L3-PWR (isolate 0.2, rank 6, no thermals): -1.32,42.01 23.22,42.01 23.22,2.72 -1.32,2.72
DETECT
  L1-HS 0.254: M.2-M1.P$57 6.25,4.7 DETECT.C
FT_RX
  L1-HS 0.17: R29.1 8.04,15.22 | 8.04,15.22 R13.2 | IC7.2 8.04,15.22
FT_TX
  L1-HS 0.17: R31.2 10.24,17.2 | 10.24,17.2 R12.1 | IC7.30 10.29,17.14 10.24,17.2
GND  (via drill 0.15, 0.2)  (9 unrouted)
  L1-HS 0.17: C29.2 6.25,38.57 v6.93,38.57 | C28.2 6.13,41.24 v6.15,41.26 | IC7.24 13.04,15.72 13.02,15.71 12.92,15.71 12.29,15.08 | 11.18,13.97 IC7.EXP 10.79,14.22 IC7.4 | 12.29,15.08 11.18,13.97 | IC7.26 12.29,15.08 | IC7.20 11.85,13.72 | 11.85,13.72 11.43,13.72 11.18,13.97 | IC7.17 13.25,12.31 12.96,12.31 11.85,13.42 11.85,13.72 | IC3.B3 v12.97,20.36 v12.97,20.35 | IC1.4 IC1.3 | IC1.3 IC1.2 | IC1.2 IC1.1 | IC1.3 19.98,40.59 IC1.9 19.98,40.09 | IC1.2 19.98,40.09 | IC1.7 19.98,40.09 | C7.2 v20.03,38.72 | C5.2 9.39,9.53 IC2.8 | v7.76,4.54 7.56,4.34 7.56,3.47 7.75,3.28 M.2-M1.P$51
  L1-HS 0.2: IC9.62 7.63,25.7 7.42,25.49 6.57,25.49 v6.53,25.53
  L1-HS 0.203: C25.2 0.45,8.83 v0.53,8.9 | v2.95,5.55 2.78,5.72 1.59,5.72 IC6.2
  L1-HS 0.254: M.2-M1.P$71 v2.75,3.54 v2.74,3.55 | C26.2 4.2,5.72 3.12,5.72 v2.95,5.55
  L6-SIG 0.17: C34.2 v8.87,35.03 | 10.42,33.99 v10.42,33.35 v10.43,33.35 | C18.2 11.64,34 v11.64,33.35 | C16.2 13.4,33.05 v13.19,33.26 13.63,33.7 C17.2 | C24.2 v13.21,31.03 v13.2,31.04 | C15.2 13.24,29.03 | 13.24,29.03 v13.22,29.05 | C14.2 13.24,29.03 | C12.2 v10.64,29.1 | C23.2 9.85,29.08 v9.83,29.1 | v8.32,29.49 v8.33,29.48 8.33,28.74 C32.2 | C36.2 7.04,28.89 v7.04,29.58 | C22.2 v8.9,30.73 | C35.2 v8.9,31.83 | C21.2 9.46,34 v9.47,34.01 | C3.2 C6.2 9.44,14.97 v10.04,14.97 | C13.2 13.18,20.14 v12.97,20.35 | M.2-M1.P$52 7.56,1.71 7.56,4.01 7.76,4.21 v7.76,4.54
  L6-SIG 0.2: 8.33,28.74 7.85,28.74 7.71,28.59 C33.2 7.71,25.78 7.46,25.53 v6.53,25.53
  L6-SIG 0.203: C2.2 2.8,5.79 2.8,5.83
  L6-SIG 0.254: 3,5.55 v2.95,5.55 2.83,5.67 2.83,5.8 2.8,5.83 | M.2-M1.P$72 M.2-M1.P$71 | M.2-M1.P$71 M.2-M1.P$70 | M.2-M1.P$71 v2.74,3.55 2.74,4.3
  L6-SIG 0.406: C1.2 2.97,5.31 C2.2
  L6-SIG 0.508: 2.74,4.3 2.74,5.08 2.97,5.31 | C2.2 2.74,4.77 v2.74,3.55
  other vias: 11.03,31.23 10.03,31.23 10.03,30.23 11.03,30.23 12.03,30.23 12.03,31.23 12.03,32.23 11.03,32.23 10.03,32.23 4.91,40.72 3.31,38.52 11.04,13.97 11.04,14.97 10.04,13.97 10.04,12.97 11.04,12.97 12.04,12.97 12.04,13.97 12.04,14.97 19.73,40.34 12.65,9.17
  pour L2-GND (isolate 0.254, no thermals): -0.97,41.99 22.93,41.99 22.93,2.73 -0.97,2.73
  pour L5-GND (isolate 0.254, no thermals): -2.16,42 23.83,42 23.83,2.72 -2.16,2.72
  pour L1-HS (isolate 0.178, rank 6, no thermals): -0.7,42.01 22.63,42.01 22.63,2.73 -0.7,2.73
  pour L6-SIG (isolate 0.178, rank 6, no thermals): -2.52,42.01 24.13,42.01 24.13,2.71 -2.52,2.71
  pour L4-SIG (isolate 0.178, no thermals): -1.76,42 23.53,42 23.53,2.71 -1.76,2.71
GP0  (1 unrouted)
  L1-HS 0.17: IC9.77 13.63,25.32 16.39,22.56 16.39,8.29 12.76,4.66 M.2-M1.P$31
GP1  (1 unrouted)
  L1-HS 0.17: M.2-M1.P$29 13.26,4.67 16.74,8.15 16.74,22.7 14.03,25.41 IC9.78
GP2
  L1-HS 0.17: IC9.79 14.43,25.5 17.09,22.85 17.09,8 13.76,4.68 M.2-M1.P$27
GP3
  L1-HS 0.17: M.2-M1.P$25 14.26,4.69 17.43,7.86 17.43,22.99 14.83,25.59 IC9.80
GP4  (via drill 0.15)
  L1-HS 0.17: M.2-M1.P$23 14.76,4.69 17.78,7.71 17.78,23.14 16.56,24.36 16.56,27.32 16.45,27.43 IC9.1 15.54,27.43 15.15,27.04 14.25,27.04 14.07,27.22 14.07,28.02 v14.12,28.07
  L6-SIG 0.17: R23.2 R4.1 17.39,41.17 17.39,41.01 17.22,40.84 15.9,40.84 15.54,40.48 15.54,33.45 15.72,33.27 15.72,28.79 15.37,28.44 14.49,28.44 v14.12,28.07
GP5  (via drill 0.15)
  L1-HS 0.17: M.2-M1.P$21 15.26,4.7 18.13,7.57 18.13,23.28 16.91,24.5 16.91,27.56 16.64,27.83 IC9.2 14.97,27.83 v14.95,27.81
  L6-SIG 0.17: R24.2 17.52,40.34 R3.1 17.5,39.89 17.26,39.66 16.59,39.66 15.89,38.96 15.89,33.59 16.07,33.42 16.07,28.64 15.52,28.09 15.23,28.09 v14.95,27.81
GP6
  L1-HS 0.17: IC9.3 16.01,28.2 16.76,28.2 17.26,27.71 17.26,24.64 18.48,23.42 18.48,7.43 15.76,4.71 M.2-M1.P$19
GP7
  L1-HS 0.17: IC9.4 16.01,28.6 16.85,28.6 17.6,27.85 17.6,24.79 18.82,23.57 18.82,7.28 16.26,4.72 M.2-M1.P$17
GP8  (1 unrouted)
  L1-HS 0.17: IC9.6 16.51,29.43 17.95,27.99 17.95,24.93 19.17,23.71 19.17,7.14 16.76,4.73 M.2-M1.P$15
GP9  (1 unrouted)
  L1-HS 0.17: M.2-M1.P$13 17.26,4.74 19.52,7 19.52,23.86 18.3,25.07 18.3,28.14 16.61,29.83 IC9.7
GP10
  L1-HS 0.17: IC9.8 16.7,30.23 18.64,28.28 18.64,25.22 19.87,24 19.87,6.85 17.76,4.75 M.2-M1.P$11
GP11
  L1-HS 0.17: M.2-M1.P$9 18.26,4.75 20.21,6.71 20.21,24.14 18.99,25.36 18.99,28.43 16.79,30.63 IC9.9
GP12
  L1-HS 0.17: IC9.11 16.48,31.43 19.34,28.57 19.34,25.51 20.56,24.29 20.56,6.56 18.76,4.76 M.2-M1.P$7
GP13
  L1-HS 0.17: M.2-M1.P$5 19.26,4.77 20.91,6.42 20.91,24.43 19.69,25.65 19.69,28.71 16.57,31.83 IC9.12
GP14
  L1-HS 0.17: IC9.13 16.66,32.23 20.04,28.86 20.04,25.8 21.26,24.57 21.26,6.28 19.76,4.78 M.2-M1.P$3
GP15
  L1-HS 0.17: M.2-M1.P$1 20.25,4.67 21.6,6.02 21.6,24.72 20.38,25.94 20.38,29 16.75,32.63 IC9.14
GP16  (via drill 0.15)
  L1-HS 0.17: IC9.16 16.68,33.43 v16.89,33.22
  L6-SIG 0.17: v16.89,33.22 16.89,32.88 16.84,32.83 16.84,31.07 17.11,30.8 17.11,27.13 17.89,26.35 17.89,8.3 15.99,6.4 15.99,5.79 13.5,3.3 M.2-M1.P$28
GP17  (via drill 0.15)
  L1-HS 0.17: IC9.17 17.24,33.83 v17.72,33.35
  L6-SIG 0.17: M.2-M1.P$26 14,3.29 16.35,5.64 16.35,6.26 18.24,8.16 18.24,26.5 17.46,27.28 17.46,30.94 17.19,31.21 17.19,32.68 17.72,33.21 v17.72,33.35
GP18  (via drill 0.15)
  L1-HS 0.17: v17.77,32.44 17.77,32.58 18.3,33.11 18.3,33.59 17.67,34.23 IC9.18
  L6-SIG 0.17: v17.77,32.44 17.77,32.1 17.67,32 17.67,31.22 17.81,31.09 17.81,27.42 18.59,26.64 18.59,8.01 16.71,6.13 16.71,5.49 14.5,3.28 M.2-M1.P$24
GP19  (via drill 0.15)
  L1-HS 0.17: v18.6,32.57 18.6,32.91 18.65,32.96 18.65,33.74 17.76,34.63 IC9.19
  L6-SIG 0.17: M.2-M1.P$22 15,3.27 17.06,5.33 17.06,5.99 18.94,7.87 18.94,26.79 18.15,27.57 18.15,31.23 18.02,31.37 18.02,31.85 18.6,32.44 v18.6,32.57
GP20  (via drill 0.15)
  L1-HS 0.17: v18.61,31.61 18.61,31.75 19.19,32.33 19.19,33.69 17.85,35.03 IC9.20
  L6-SIG 0.17: v18.61,31.61 18.61,31.27 18.5,31.17 18.5,27.71 19.28,26.93 19.28,7.72 17.41,5.85 17.41,5.18 15.5,3.27 M.2-M1.P$20
GP21  (via drill 0.15)
  L1-HS 0.17: v19.43,31.74 19.27,31.74 19.27,31.92 19.54,32.19 19.54,33.83 16.89,36.48 14.9,36.48 14.83,36.41 IC9.21
  L6-SIG 0.17: M.2-M1.P$18 16,3.26 17.77,5.03 17.77,5.72 19.63,7.58 19.63,27.07 18.85,27.85 18.85,31.02 19.19,31.37 19.19,31.5 v19.43,31.74
GP22  (via drill 0.15)
  L1-HS 0.17: v19.44,30.78 19.44,30.92 20.02,31.5 20.02,33.84 17.02,36.85 14.68,36.85 14.43,36.6 IC9.22
  L6-SIG 0.17: v19.44,30.78 19.44,30.44 19.33,30.33 19.33,27.86 19.98,27.22 19.98,7.44 18.13,5.59 18.13,4.89 16.5,3.26 M.2-M1.P$16
GP23  (via drill 0.15)
  L1-HS 0.17: v20.26,30.91 20.26,31.25 20.37,31.36 20.37,33.99 17.16,37.2 14.53,37.2 14.03,36.69 IC9.23
  L6-SIG 0.17: M.2-M1.P$14 17,3.24 18.48,4.72 18.48,5.45 20.33,7.29 20.33,27.36 19.68,28.01 19.68,30.19 20.33,30.84 20.33,30.85 v20.26,30.91
GP24  (via drill 0.15)
  L1-HS 0.17: v20.27,29.95 20.27,30.08 20.85,30.67 20.85,33.99 17.3,37.54 14.17,37.54 13.23,36.6 IC9.25
  L6-SIG 0.17: v20.27,29.95 20.27,29.61 20.04,29.38 20.04,28.14 20.67,27.5 20.67,7.15 18.84,5.31 18.84,4.58 17.5,3.24 M.2-M1.P$12
GP25  (via drill 0.15)  (1 unrouted)
  L1-HS 0.17: v21.1,30.08 21.1,30.42 21.2,30.52 21.2,34.14 17.45,37.89 14.03,37.89 12.83,36.69 IC9.26
  L6-SIG 0.17: M.2-M1.P$10 18,3.22 19.19,4.41 19.19,5.18 21.02,7 21.02,27.65 20.38,28.29 20.38,29.23 21.02,29.87 21.02,30 v21.1,30.08
GP26  (via drill 0.15)
  L1-HS 0.17: v20.97,28.99 20.97,29.12 21.68,29.84 21.68,34.15 17.59,38.24 13.88,38.24 12.43,36.79 IC9.27
  L6-SIG 0.17: v20.97,28.99 20.97,28.19 21.37,27.79 21.37,6.86 19.55,5.04 19.55,4.27 18.5,3.22 M.2-M1.P$8
GP27  (via drill 0.15)
  L1-HS 0.17: IC9.28 12.03,36.88 13.74,38.59 17.73,38.59 21.14,35.18 v21.48,35.18
  L6-SIG 0.17: M.2-M1.P$6 19,3.21 19.9,4.11 19.9,4.9 21.71,6.71 21.71,34.95 v21.48,35.18
GP28  (via drill 0.15)  (1 unrouted)
  L6-SIG 0.17: M.2-M1.P$4 19.5,3.19 20.25,3.94 20.25,4.62 20.62,4.99 21.43,4.99 v21.47,4.95
GP29  (via drill 0.15)  (1 unrouted)
  L6-SIG 0.17: v20.84,4.37 20.84,4.02 20,3.17 M.2-M1.P$2
GP30  (1 unrouted)
GP31  (1 unrouted)
  L6-SIG 0.17: M.2-M1.P$34 12,3.05 12.84,3.89 13.6,3.89
GP32  (1 unrouted)
  L6-SIG 0.17: M.2-M1.P$36 11.5,3.04 12.7,4.24 13.53,4.24 15.41,6.12
GP33  (1 unrouted)
  L6-SIG 0.17: M.2-M1.P$38 11,3.09 12.5,4.59 13.39,4.59 15.41,6.61 15.41,8.76
GP34  (1 unrouted)
  L6-SIG 0.17: M.2-M1.P$40 10.5,3.08 12.36,4.94 13.24,4.94 13.5,5.2 13.56,5.25 15.06,6.76 15.06,8.93
GP35  (1 unrouted)
  L6-SIG 0.17: M.2-M1.P$42 10,3.08 12.2,5.28 13.1,5.28 14.72,6.9 14.72,9.12
GP36  (via drill 0.15)
  L1-HS 0.17: IC9.45 4.41,33.43 0.55,29.57 0.55,22.76 1.52,21.79 1.52,15.85 v1.28,15.61
  L6-SIG 0.17: v1.28,15.61 1.51,15.38 1.89,15.38 3.6,13.66 3.6,13.32 5.7,11.22 12.9,11.22 14.37,9.76 14.37,7.04 12.96,5.63 12.06,5.63 9.5,3.07 M.2-M1.P$44
GP37  (via drill 0.15)
  L1-HS 0.17: v1.63,14.79 1.87,15.03 1.87,21.94 0.9,22.91 0.9,29.42 4.5,33.03 IC9.46
  L6-SIG 0.17: M.2-M1.P$46 9,3.07 11.9,5.98 12.8,5.98 14.01,7.19 14.01,9.62 12.76,10.88 5.56,10.88 3.26,13.18 3.26,13.52 1.99,14.79 v1.63,14.79
GP38  (via drill 0.15)
  L1-HS 0.17: IC9.47 4.6,32.63 1.24,29.28 1.24,23.05 2.21,22.08 2.21,14.21 v1.97,13.96
  L6-SIG 0.17: v1.97,13.96 2.21,13.72 2.57,13.72 2.91,13.37 2.91,13.03 5.41,10.53 12.61,10.53 13.65,9.49 13.65,7.33 12.65,6.33 11.74,6.33 8.5,3.08 M.2-M1.P$48
GP39  (via drill 0.15)
  L1-HS 0.17: v2.32,13.13 2.56,13.37 2.56,22.23 1.59,23.2 1.59,29.14 4.69,32.23 IC9.48
  L6-SIG 0.17: M.2-M1.P$50 8,3.08 11.59,6.67 12.46,6.67 13.29,7.5 13.29,9.36 12.47,10.18 5.27,10.18 v2.32,13.13
GP40  (via drill 0.15)
  L1-HS 0.17: M.2-M1.P$49 8.25,3.12 8.69,3.56 8.69,4.5 7.82,5.37 v7.79,5.37 | IC9.49 4.78,31.83 1.94,28.99 1.94,23.34 2.91,22.37 2.91,9.57 3.07,9.41 v3.07,9.07
  L4-SIG 0.17: v3.07,9.07 3.07,7.71 3,7.64 3,7.16 4.41,5.75 7.42,5.75 v7.79,5.37
GP41  (via drill 0.15)
  L1-HS 0.17: M.2-M1.P$47 8.75,3.11 9.04,3.4 9.04,4.67 8.39,5.32 8.39,5.78 v7.99,6.18 | v3.9,8.73 3.9,9.07 3.26,9.71 3.26,22.54 2.29,23.51 2.29,28.85 4.07,30.63 IC9.52
  L4-SIG 0.17: v3.9,8.73 4.14,8.49 4.14,8.15 4.35,7.94 4.35,7.47 5.49,6.32 7.85,6.32 v7.99,6.18
GP42  (via drill 0.15)
  L1-HS 0.17: M.2-M1.P$45 9.25,3.09 9.39,3.23 9.39,4.82 8.84,5.37 v8.84,6.17 | IC9.53 4.16,30.23 2.64,28.7 2.64,23.66 3.6,22.69 3.6,9.85 4.48,8.97 4.48,8.29 4.94,7.84 v4.94,7.71
  L4-SIG 0.17: v4.94,7.71 4.94,7.84 4.48,8.29 4.48,8.78 4.83,9.13 5.91,9.13 7.31,10.53 12.12,10.53 13.31,9.34 13.31,7.33 10.69,4.71 9.43,4.71 8.84,5.3 v8.84,6.17
GP43  (via drill 0.15)
  L1-HS 0.17: M.2-M1.P$43 9.75,5.46 v9.54,5.67 | IC9.54 4.25,29.83 2.98,28.56 2.98,23.8 3.95,22.83 3.95,10 5.07,8.88 v5.07,8.54
  L4-SIG 0.17: v5.07,8.54 5.81,8.54 7.46,10.18 9.67,10.18 11.73,8.12 11.73,6.25 11.06,5.57 9.64,5.57 v9.54,5.67
GP44  (via drill 0.15)
  L1-HS 0.17: IC9.55 6.05,29.4 4.32,29.4 3.33,28.41 3.33,23.95 4.3,22.98 4.3,10.14 5.66,8.78 5.66,8.1 5.76,8 v5.76,7.66 | M.2-M1.P$41 10.25,3.47 10.71,3.93 10.71,5.44 9.63,6.52 v9.61,6.52
  L4-SIG 0.17: 5.9,7.66 v5.76,7.66 5.97,7.46 5.97,7.04 6.31,6.69 6.8,6.69 6.88,6.78 9.35,6.78 v9.61,6.52
GP45  (via drill 0.15)
  L1-HS 0.17: IC9.56 4.43,29.02 3.68,28.27 3.68,24.09 4.65,23.12 4.65,10.29 6.01,8.93 6.01,8.25 6.55,7.7 v6.55,7.28 | v10.43,6.54 11.05,5.92 11.05,3.78 10.81,3.54 10.81,1.71 M.2-M1.P$39
  L4-SIG 0.17: v6.55,7.28 6.89,7.28 7.05,7.12 10.03,7.12 10.43,6.71 v10.43,6.54
GP46  (via drill 0.15)
  L1-HS 0.17: IC9.57 5.39,28.63 5.35,28.68 4.57,28.68 4.03,28.13 4.03,24.23 4.99,23.26 4.99,10.43 6.6,8.83 v6.6,8.49 | v11.11,7.03 11.4,6.74 11.4,3.1 11.31,3.01 11.31,1.71 M.2-M1.P$37
  L4-SIG 0.17: v6.6,8.49 6.8,8.29 6.8,7.87 7.19,7.47 10.67,7.47 v11.11,7.03
GP47  (via drill 0.15)
  L1-HS 0.17: IC9.58 5.3,28.23 5.2,28.33 4.72,28.33 4.37,27.98 4.37,24.38 5.34,23.41 5.34,10.57 7.31,8.6 7.31,8.52 7.39,8.45 v7.39,8.11 | v11.13,7.87 11.75,7.24 M.2-M1.P$35
  L4-SIG 0.17: v7.39,8.11 7.45,8.18 10.82,8.18 v11.13,7.87
I2C0_SCL  (via drill 0.15)
  L1-HS 0.17: IC1.6 16.6,40.59 v16.18,40.17
  L6-SIG 0.17: R3.2 16.8,40.17 v16.18,40.17
I2C0_SDA  (via drill 0.15)
  L1-HS 0.17: IC1.5 16.51,41.09 v16.14,41.46
  L6-SIG 0.17: R4.2 16.79,41.46 v16.14,41.46
LX  (via drill 0.15)
  L1-HS 0.2: v4.96,27.74 4.96,26.99 | 4.96,26.99 v4.96,26.91 | IC9.63 8.02,26.29 8.02,26.73 7.76,26.99 4.96,26.99
  L6-SIG 0.2: L1.2 4.54,27.32 v4.96,27.74
  pour L6-SIG (isolate 0.254, no thermals): 1.31,28.21 1.31,26.44 5.52,26.44 5.52,28.21
MUXSEL  (1 unrouted)
  L1-HS 0.17: R11.1 R7.1 R5.2
N$6
  L1-HS 0.254: DETECT.A 6.12,6.43 R16.1
N$43
  L1-HS 0.17: IC7.22 14.08,14.72 R10.1
N$53
  L1-HS 0.17: X1.1 4.91,38.62 5.54,39.24 C29.1 R6.1
N$109
  L1-HS 0.17: IC7.21 14.19,14.22 R9.1
N$110
  L1-HS 0.17: R9.2 14.51,13.59 14.72,13.79 14.72,17.41 TX.C
N$111
  L1-HS 0.17: R10.2 14.27,16.35 13.72,16.9 12.32,16.9 11.94,17.28 RX.C
QSPI_SCLK  (via drill 0.15)
  L1-HS 0.17: IC9.71 11.23,25.75 9.51,24.03 arc-45 v8.95,23.8 | IC3.B2 12.5,21.85 v12,22.36
  L4-SIG 0.17: v8.95,23.8 10.55,23.8 v12,22.36
QSPI_SD0
  L1-HS 0.17: IC9.72 11.63,25.6 10.99,24.96 arc90 10.99,24.72 11.09,24.61 arc-90 11.09,24.37 11.08,24.35 arc-90 10.83,24.35 10.73,24.45 arc90 10.48,24.45 10.47,24.43 arc90 10.47,24.19 10.57,24.09 arc-90 10.57,23.84 10.55,23.82 arc-90 10.3,23.82 10.2,23.93 arc90 9.96,23.93 9.94,23.91 arc90 9.94,23.66 10.04,23.56 arc-90 10.04,23.32 10.02,23.3 arc-90 9.78,23.3 9.68,23.4 arc90 9.43,23.4 9.2,23.17 arc45 8.99,22.67 8.99,21.89 arc90 9.55,21.33 arc-45 10.02,21.14 10.2,20.95 arc45 IC3.D3
QSPI_SD1  (via drill 0.15)
  L1-HS 0.17: v12,20.37 11.94,20.43 11.94,20.95 arc90 11.62,21.27 arc-45 11.14,21.47 10.97,21.63 arc45 IC3.D2 | v13.01,22.35 13.01,22.71 arc45 12.73,23.38 12.59,23.52 arc-45 12.43,23.9 12.43,24.14 arc-90 12.6,24.31 12.72,24.31 arc90 12.9,24.49 12.9,24.64 arc90 12.72,24.82 12.6,24.82 arc-90 12.43,24.99 IC9.74
  L4-SIG 0.17: v12,20.37 12,20.95 arc-45 12.28,21.62 v13.01,22.35
QSPI_SD2
  L1-HS 0.17: IC9.73 12.03,25.19 arc-90 11.86,25.02 11.63,25.02 arc90 11.45,24.84 arc90 11.64,24.65 11.86,24.65 arc-90 12.03,24.48 12.03,24.36 arc-45 11.84,23.91 11.83,23.9 arc-90 11.59,23.9 11.56,23.93 arc90 11.32,23.93 11.28,23.88 arc90 11.28,23.64 11.3,23.62 arc-90 11.3,23.37 11.11,23.18 arc45 11.02,22.96 arc-45 10.85,22.55 10.75,22.45 arc-45 10.43,22.32 arc90 9.99,21.88 9.99,21.81 arc45 10.09,21.56 10.14,21.51 arc45 10.6,21.32 arc-90 11.06,20.86 11.06,20.45 arc45 11.19,20.14 IC3.C4
QSPI_SD3  (via drill 0.15)
  L1-HS 0.17: IC9.70 10.82,25.85 9.59,24.62 arc-45 9.09,24.41 8.96,24.41 arc45 8.45,24.2 arc45 8.14,23.45 v8.14,23.43 | v9.98,20.35 IC3.D4
  L4-SIG 0.17: v8.14,23.43 8.85,22.73 arc-90 8.85,22.48 8.74,22.37 arc90 8.74,22.13 8.79,22.08 arc90 9.03,22.08 9.14,22.19 arc-90 9.39,22.19 9.55,22.02 arc-45 9.98,21 v9.98,20.35
REGO  (2 unrouted)
RP_XI
  L1-HS 0.17: IC9.30 11.23,38.03 10.61,38.65 9.18,38.65 7.55,40.28 6.66,40.28 6.38,40 C28.1 5.88,39.76 4.12,39.76 3.31,40.57 X1.3
RP_XO
  L1-HS 0.17: R6.2 7.54,39.79 9.04,38.3 10.47,38.3 10.83,37.94 IC9.31
RUN  (2 unrouted)
SWCLK  (1 unrouted)
SWCLK_M2  (1 unrouted)
SWDIO  (1 unrouted)
SWDIO_M2  (1 unrouted)
USB_DP_N
  L1-HS 0.167: M.2-M1.P$53 7.25,3.23 7.16,3.32 7.16,6.57 7.94,7.35 10.17,7.35 10.53,7.71 IC2.2
USB_DP_P
  L1-HS 0.167: M.2-M1.P$55 6.75,3.25 6.82,3.32 6.82,6.71 7.8,7.69 10.03,7.69 10.13,7.79 IC2.1
USBFT_DP_N
  L1-HS 0.167: IC2.6 10.53,10.01 10.99,10.47 12,10.47 12.29,10.76 IC7.15
USBFT_DP_P
  L1-HS 0.167: IC2.7 10.13,10.09 10.85,10.81 11.7,10.81 11.79,10.9 IC7.14
USBRP2_DP_N
  L1-HS 0.167: R32.2 6.05,23.78 6.58,24.31 6.98,24.31 7.91,25.25 8.77,25.25 9.23,25.71 IC9.66
USBRP2_DP_P
  L1-HS 0.167: IC9.67 9.63,25.51 9.02,24.9 8.07,24.9 7.14,23.96 6.7,23.96 6.49,23.75 R33.2
USBRP_DP_N  (via drill 0.15)
  L1-HS 0.167: IC2.4 11.92,8.99 v11.92,8.77 | v7.9,8.77 7.9,9.01 7.4,9.01 5.96,10.45 5.96,22.78 R32.1
  L6-SIG 0.167: v11.92,8.77 11.92,9.01 7.9,9.01 v7.9,8.77
USBRP_DP_P  (via drill 0.15)
  L1-HS 0.167: IC2.5 11.92,9.39 v11.92,9.59 | v7.9,9.59 7.9,9.35 7.54,9.35 6.3,10.59 6.3,22.77 R33.1
  L6-SIG 0.167: v11.92,9.59 11.92,9.35 7.9,9.35 v7.9,9.59
VBUS  (via drill 0.15)  (2 unrouted)
  L1-HS 0.17: IC7.19 13.87,13.22 R14.2 | RX.A TX.A | M.2-M1.P$75 M.2-M1.P$74 M.2-M1.P$73
  L1-HS 0.254: C25.1 0.45,6.73 | 0.45,6.73 0.45,5.06 0.71,4.8 IC6.3 | IC6.1 1.53,6.73 1.21,6.73 0.45,6.73 | v1.57,3.48 1.58,3.47 2,3.47
  L1-HS 0.406: M.2-M1.P$74 2,3.47 2,3.8 1.56,4.24 IC6.3 | v1.15,8.35 1.01,8.21 1.01,6.93 1.21,6.73
  L6-SIG 0.254: 1.65,3.56 1.59,3.49 | 1.59,3.49 v1.57,3.48 | M.2-M1.P$74 2,3.08 1.59,3.49
  L6-SIG 0.406: C1.1 1.2,8.3 v1.15,8.35
VCCIO  (via drill 0.15)  (1 unrouted)
  L1-HS 0.17: R14.1 R15.2 | v8.49,16.51 8.74,16.26 IC7.1
  L6-SIG 0.17: C6.1 C3.1 8.83,16.16 v8.49,16.51
VCORE  (via drill 0.15)  (3 unrouted)
  L1-HS 0.17: IC9.10 v15.13,31.03 | IC9.32 v10.43,35.23 | IC9.51 6.69,31.03 v6.99,30.73
  L3-PWR 0.203: v11.43,27.57 11.43,28.29 | v15.13,31.03 15.13,30.62 14.66,30.15 13.29,30.15 11.43,28.29 | v6.99,30.73 7.52,30.2 8.5,30.2 8.96,29.74 8.96,28.64 9.31,28.29 11.43,28.29
  L6-SIG 0.17: C22.1 v7,30.74 v6.99,30.73 | 10.42,34.54 v10.42,35.22 v10.43,35.23
  L6-SIG 0.203: J3.2 10.31,25.8 11.43,26.91 v11.43,27.57
VREG_AVDD  (via drill 0.15)
  L1-HS 0.2: v6.43,26.36 6.51,26.28 IC9.61
  L6-SIG 0.2: R2.2 6.32,26.47 v6.43,26.36 6.81,26.36 C33.1
VREGO  (via drill 0.15)
  L1-HS 0.17: IC9.65 8.83,26.89 v9.13,27.19
  L6-SIG 0.17: 9.04,27.12 J3.1 8.72,26.34 8.59,26.21 8.59,25.74 6.67,23.82 L1.1 | 9.04,27.12 9.04,27.88 C11.1 | v9.13,27.19 9.11,27.19 9.04,27.12
  pour L6-SIG (isolate 0.254, no thermals): 7.36,24.75 7.36,24.75 8.41,25.8 8.41,27.82 8.65,28.06 9.3,28.06 9.3,25.91 6.31,22.92 1.3,22.92 1.3,24.75

### Text on the board
L1-HS: 1
L2-GND: 2
L3-PWR: 3
L4-SIG: 4
L5-GND: 5
L6-SIG: 6
tNames: VCORE | J3 | R11/01 | T11 | T01 | M1 | M2 | M3
bNames: DvidMakesThings 2025 | J2 | J1 | R3 | R4